# EAGLE design dualpowersupply (EAGLE 9.6.2)
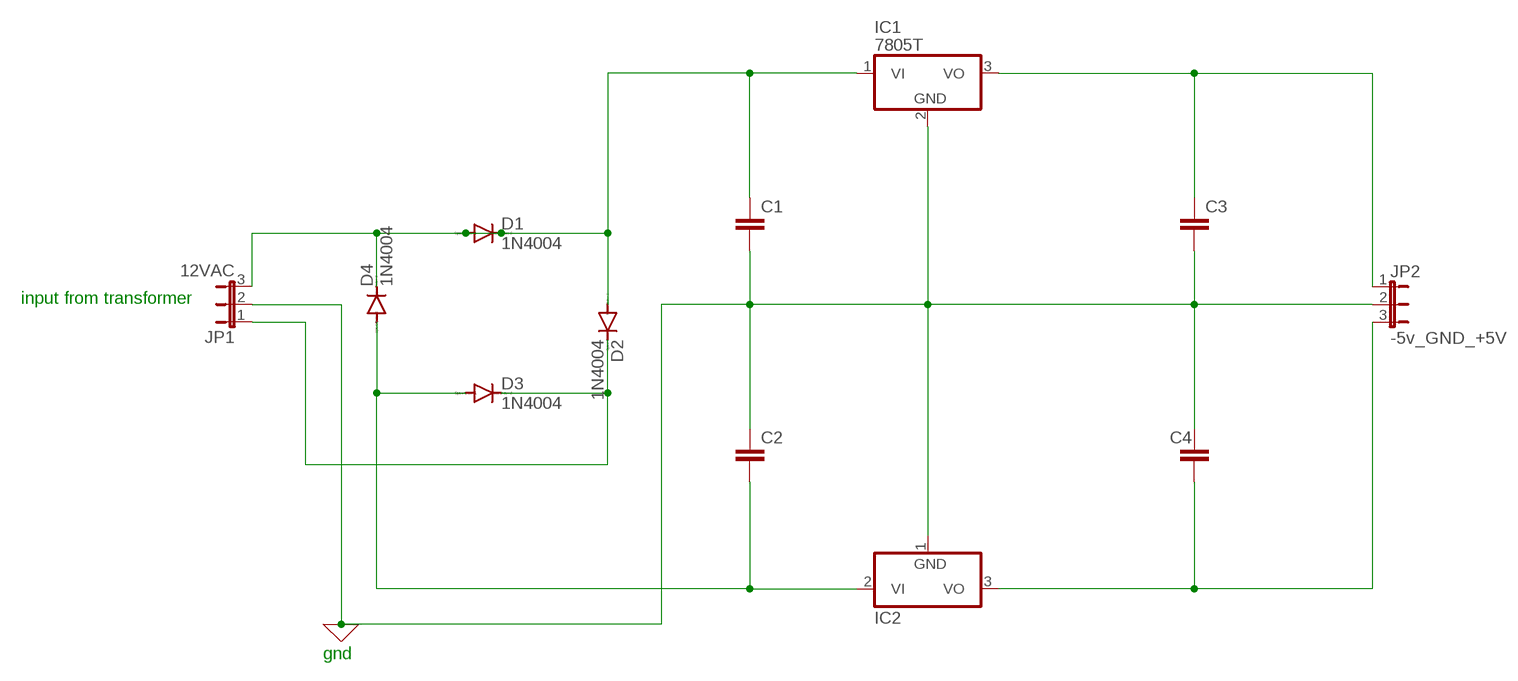
[diagram p0: schematic, sheet 1]

## Parts
C1  C2,5-3  [C2.5-3]
C2  C2,5-3  [C2.5-3]
C3  C2,5-3  [C2.5-3]
C4  C2,5-3  [C2.5-3]
D1  1N4004  [DO41-10]
D2  1N4004  [DO41-10]
D3  1N4004  [DO41-10]
D4  1N4004  [DO41-10]
IC1  7805T  [TO220H]
IC2  7905T  [TO220H]
JP1  12VAC  JP2W  [JP2W]
JP2  -5v_GND_+5V  JP2W  [JP2W]

## Nets
0: C1.2 C2.1 C3.2 C4.1 IC1.2(GND) IC2.1(GND) JP1.2 JP2.2 ; supply symbol labelled GND
N$1: C1.1 D1.A D1.C D2.A D4.C IC1.1(VI) JP1.3
N$2: C2.2 D3.A D4.A IC2.2(VI)
N$3: D2.C D3.C JP1.1
N$5: C3.1 IC1.3(VO) JP2.1
N$6: C4.2 IC2.3(VO) JP2.3

## Notes on the sheet
- input from transformer
- gnd

## Library data of the parts
C1-C4 = capacitor-wima:C: CAPACITOR naming: grid - package width
D1-D4 = diode:1N4004: DIODE general purpose rectifier, 1 A
IC1 = linear:78*: Positive VOLTAGE REGULATOR Source: http://cache.national.com/ds/LM/LM78L05.pdf http://www.fairchildsemi.com/ds/LM/LM7805.pdf
IC2 = linear:79*: Negative VOLTAGE REGULATOR
JP1 JP2 = jumper:JP2W: JUMPER

## Board
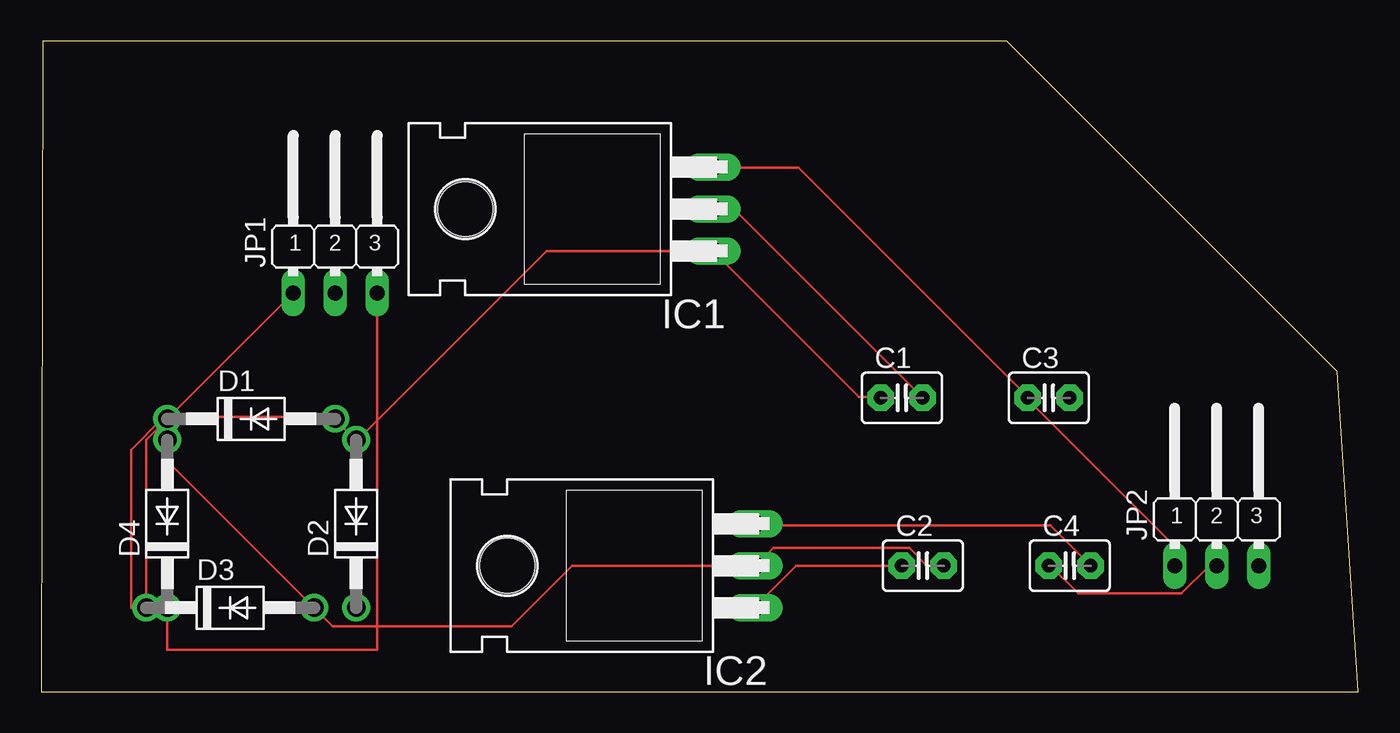
[diagram p1: board, top side]
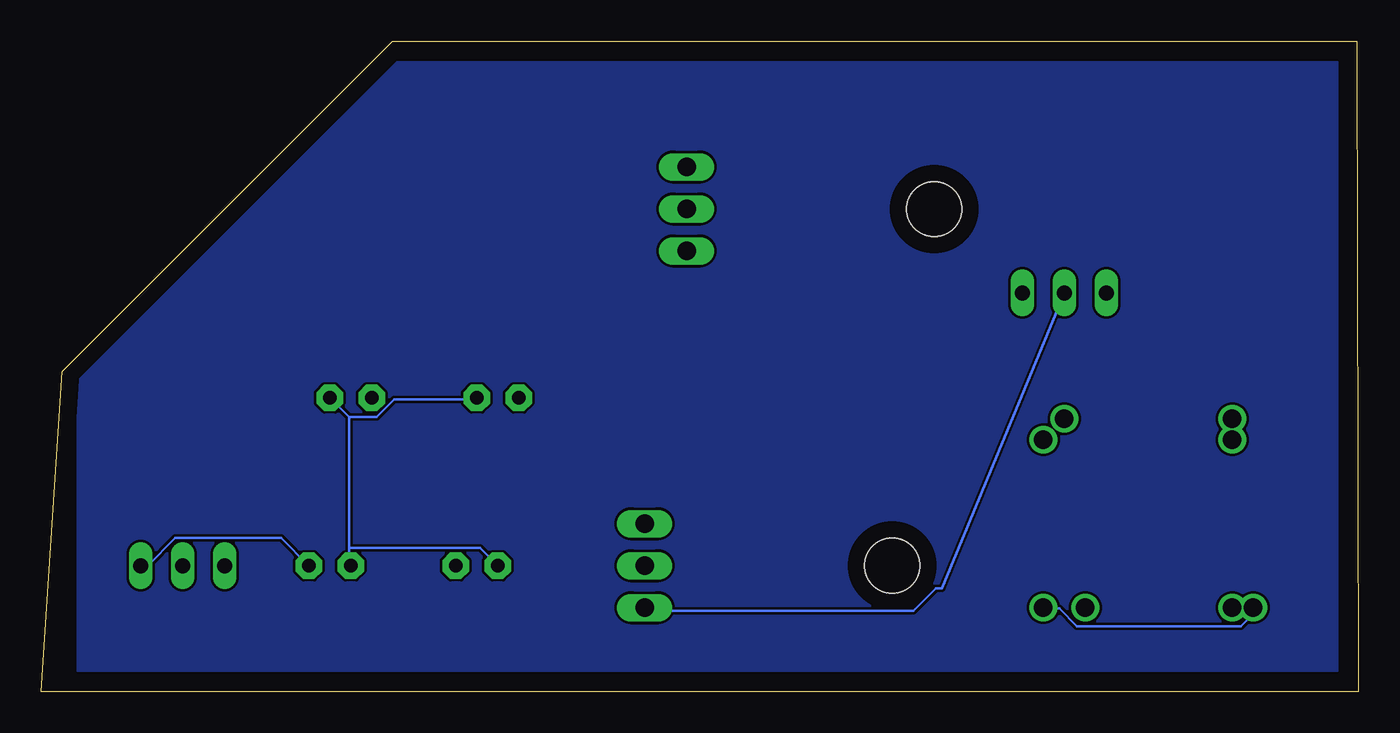
[diagram p2: board, bottom side, seen from below]

Size 79.68 x 39.36 mm. Coordinates in mm from the lower left corner, seen from the top.
Outline: 0,0 79.68,0 78.41,19.38 58.43,39.36 0.08,39.36 0,0
Copper layers (1*16): Top 0.035mm / dielectric 1.5mm / Bottom 0.035mm
Design rules "default": minimum track width 6mil, minimum drill 0.35mm, track to track 6mil, track to pad 6mil, pad to pad 6mil, via to via 6mil, smd to smd 6mil, copper to edge 40mil, drill to drill 6mil, minimum pad ring 10mil, minimum via ring 8mil, stop-mask expansion 4mil, vias tented up to drill 0mil, thermal gap 10mil

### Footprints (pad centres in the part's own frame; a part is rotated, then mirrored left to right if it is on the bottom)
C2.5-3 = drill 0.813 pad 1.6 octagon: 1 -1.27,0; 2 1.27,0
DO41-10 = drill 1.118: A 5.08,0; C -5.08,0
TO220H = drill 1.118 long: 1 -2.54,-10.16; 2 0,-10.16; 3 2.54,-10.16 | hole 3.302: 0,4.826
JP2W = drill 0.914 long: 1 -2.54,-1.27; 2 0,-1.27; 3 2.54,-1.27

### Placement (x,y rotation side)
C1  52.07,17.78 0 top
C2  53.34,7.62 0 top
C3  60.96,17.78 0 top
C4  62.23,7.62 0 top
D1  12.7,16.51 0 top
D2  19.05,10.16 90 top
D3  11.43,5.08 0 top
D4  7.62,10.16 90 top
IC1  30.48,29.21 90 top
IC2  33.02,7.62 90 top
JP1  17.78,25.4 0 top
JP2  71.12,8.89 0 top

### Tracks (layer width: path | path; a pad name or v marks a point on that pad's centre or on a via)
0
  Top 0.152: JP2.2 70.66,7.62 68.99,5.94 62.74,5.94 61.06,7.62 C4.1 | C1.2 42.01,29.11 40.64,29.11 IC1.2 | C2.1 45.67,7.62 43.23,5.18 IC2.1
  Bottom 0.152: 61.06,16.61 59.38,16.61 58.32,17.68 53.44,17.68 C1.2 | C3.2 61.06,16.61 | 61.06,16.61 61.06,8.69 | 61.06,8.69 61.06,7.62 C4.1 | JP1.2 25.19,6.25 25.55,6.25 26.92,4.88 42.93,4.88 43.08,5.03 IC2.1 | 61.06,8.69 53.14,8.69 C2.1
GND
  pour Bottom: 1.27,38.1 58.42,38.1 77.47,19.05 77.47,1.27 1.27,1.27
N$1
  Top 0.152: C1.1 50.7,17.83 49.48,17.83 IC1.1 30.58,26.67 19.15,15.24 D2.A 19,15.24 17.78,16.46 D1.A 17.78,16.61 7.72,16.61 D1.C 7.57,16.46 7.26,16.46 5.44,14.63 5.44,5.08 D4.C 7.62,2.54 20.32,2.54 JP1.3
N$2
  Top 0.152: C2.2 53.59,7.62 52.53,8.69 44.3,8.69 43.23,7.62 IC2.2 32.11,7.62 28.45,3.96 17.63,3.96 D3.A 7.72,13.87 7.72,15.24 D4.A
N$3
  Top 0.152: JP1.1 6.35,15.24 D3.C
  Bottom 0.152: D3.C 6.35,4.72 7.11,3.96 17.02,3.96 18.09,5.03 19,5.03 D2.C
N$5
  Top 0.152: JP2.1 68.53,7.62 68.53,8.84 59.69,17.68 C3.1 59.69,17.83 45.82,31.7 40.64,31.7 IC1.3
N$6
  Top 0.152: C4.2 61.06,10.06 43.23,10.06 IC2.3
  Bottom 0.152: JP2.3 73.25,7.62 71.58,9.3 65.18,9.3 C4.2